# Altium project Spectre-Analyzer.PrjPcb
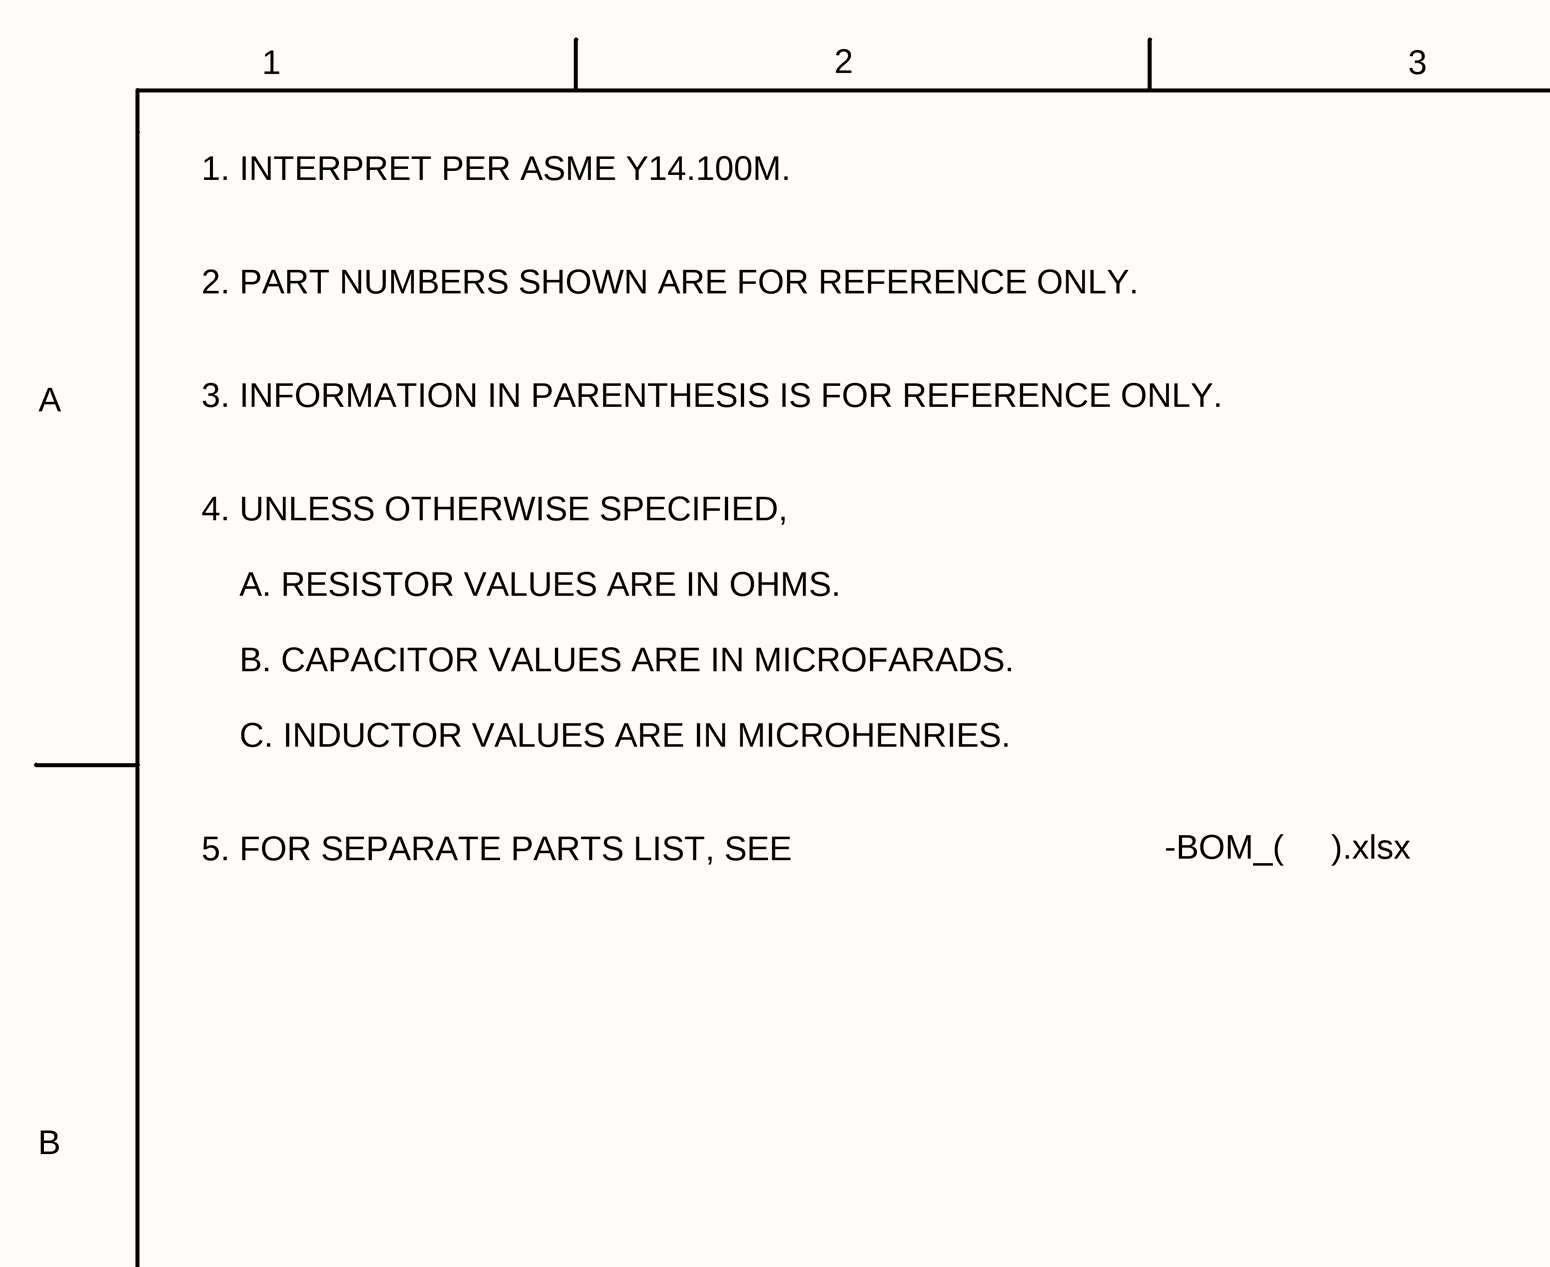
[diagram p0: Spectre-Analyzer-SCH_SH1_(C).SchDoc, top left]
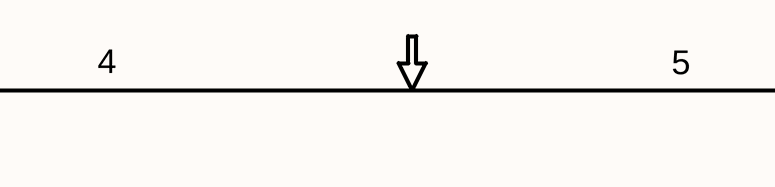
[diagram p1: Spectre-Analyzer-SCH_SH1_(C).SchDoc, top middle]
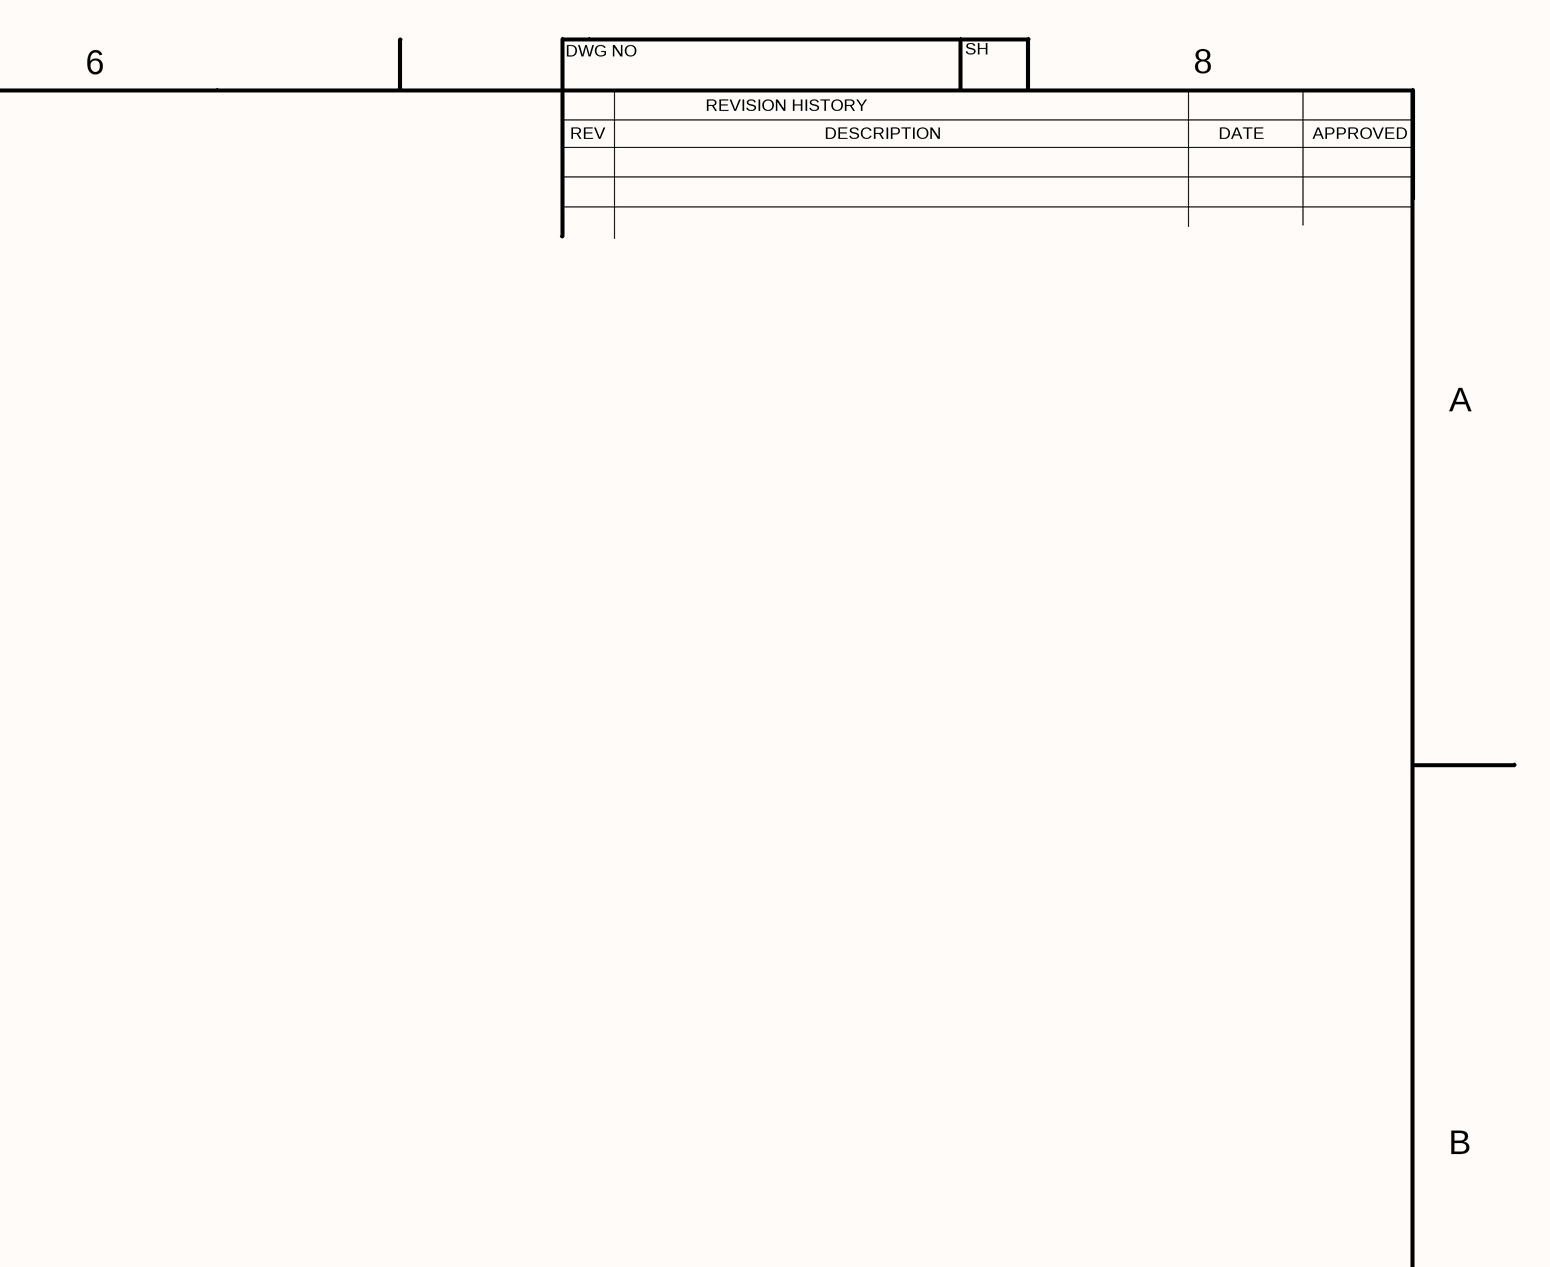
[diagram p2: Spectre-Analyzer-SCH_SH1_(C).SchDoc, top right]
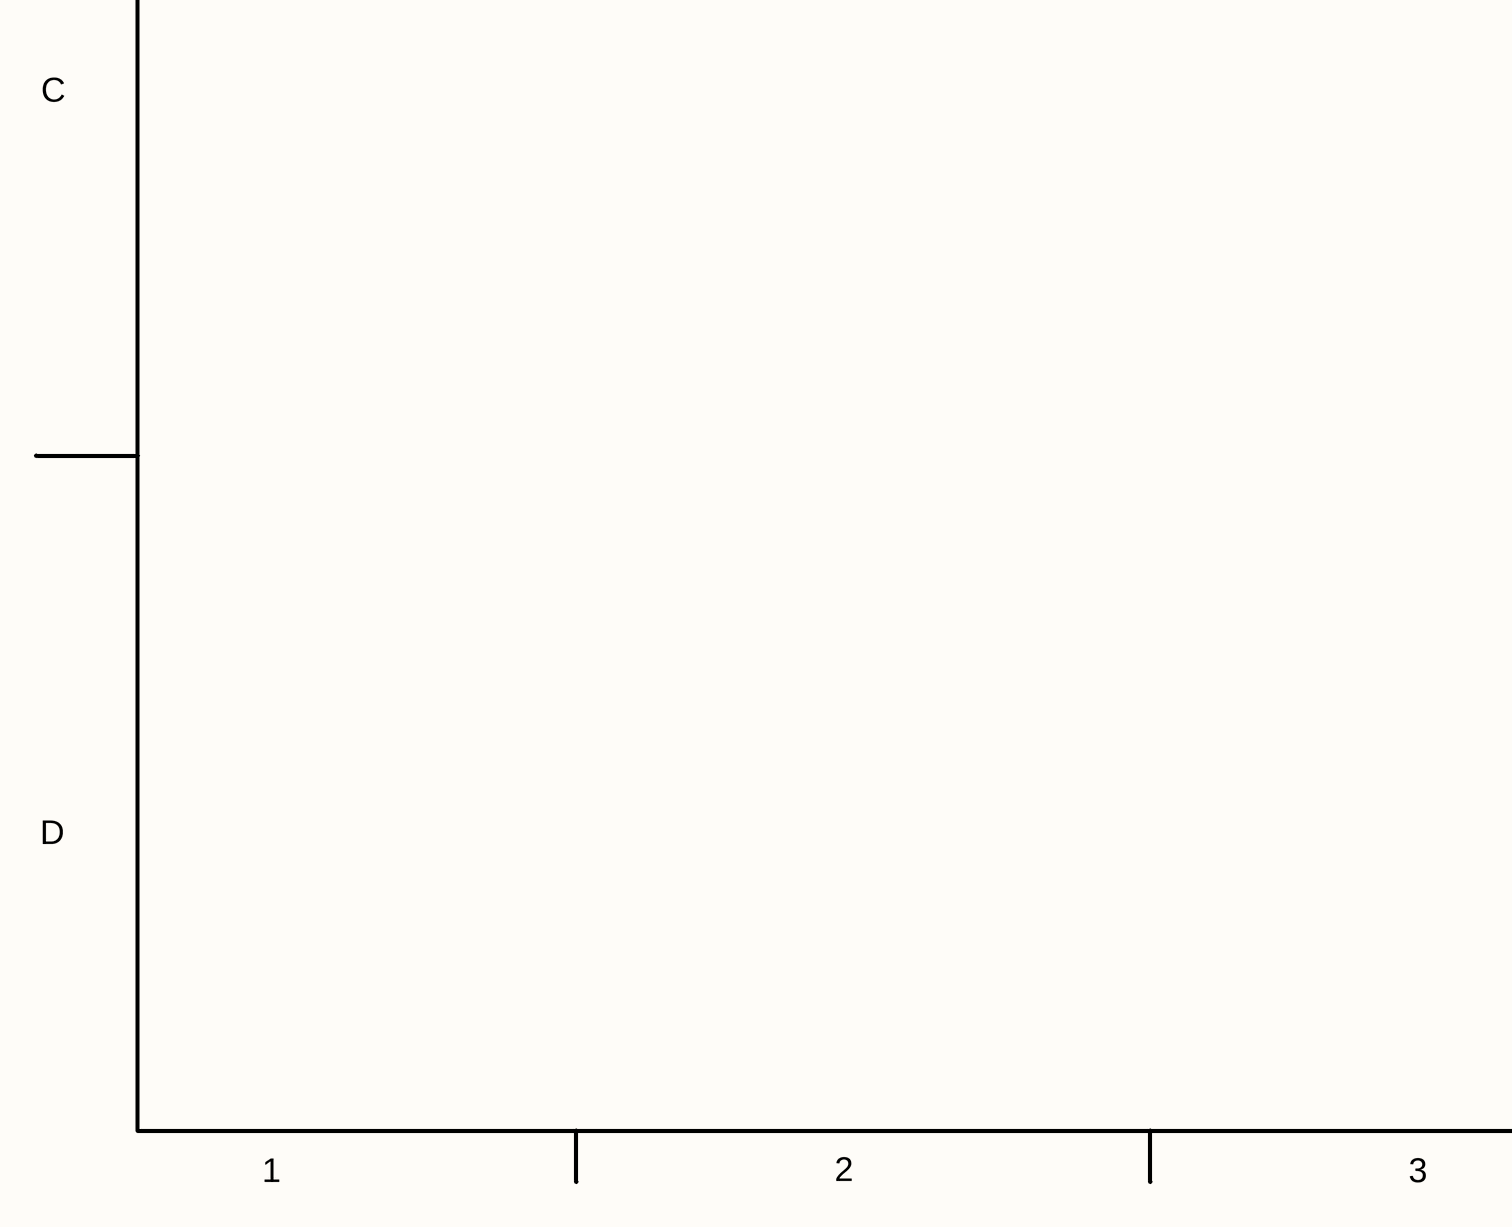
[diagram p3: Spectre-Analyzer-SCH_SH1_(C).SchDoc, bottom left]
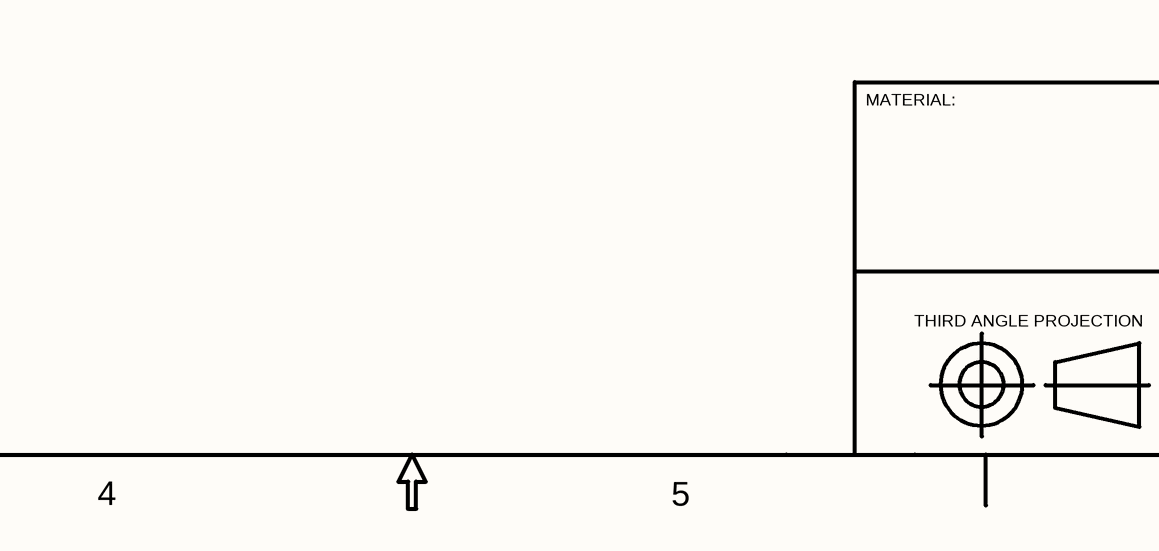
[diagram p4: Spectre-Analyzer-SCH_SH1_(C).SchDoc, bottom middle]
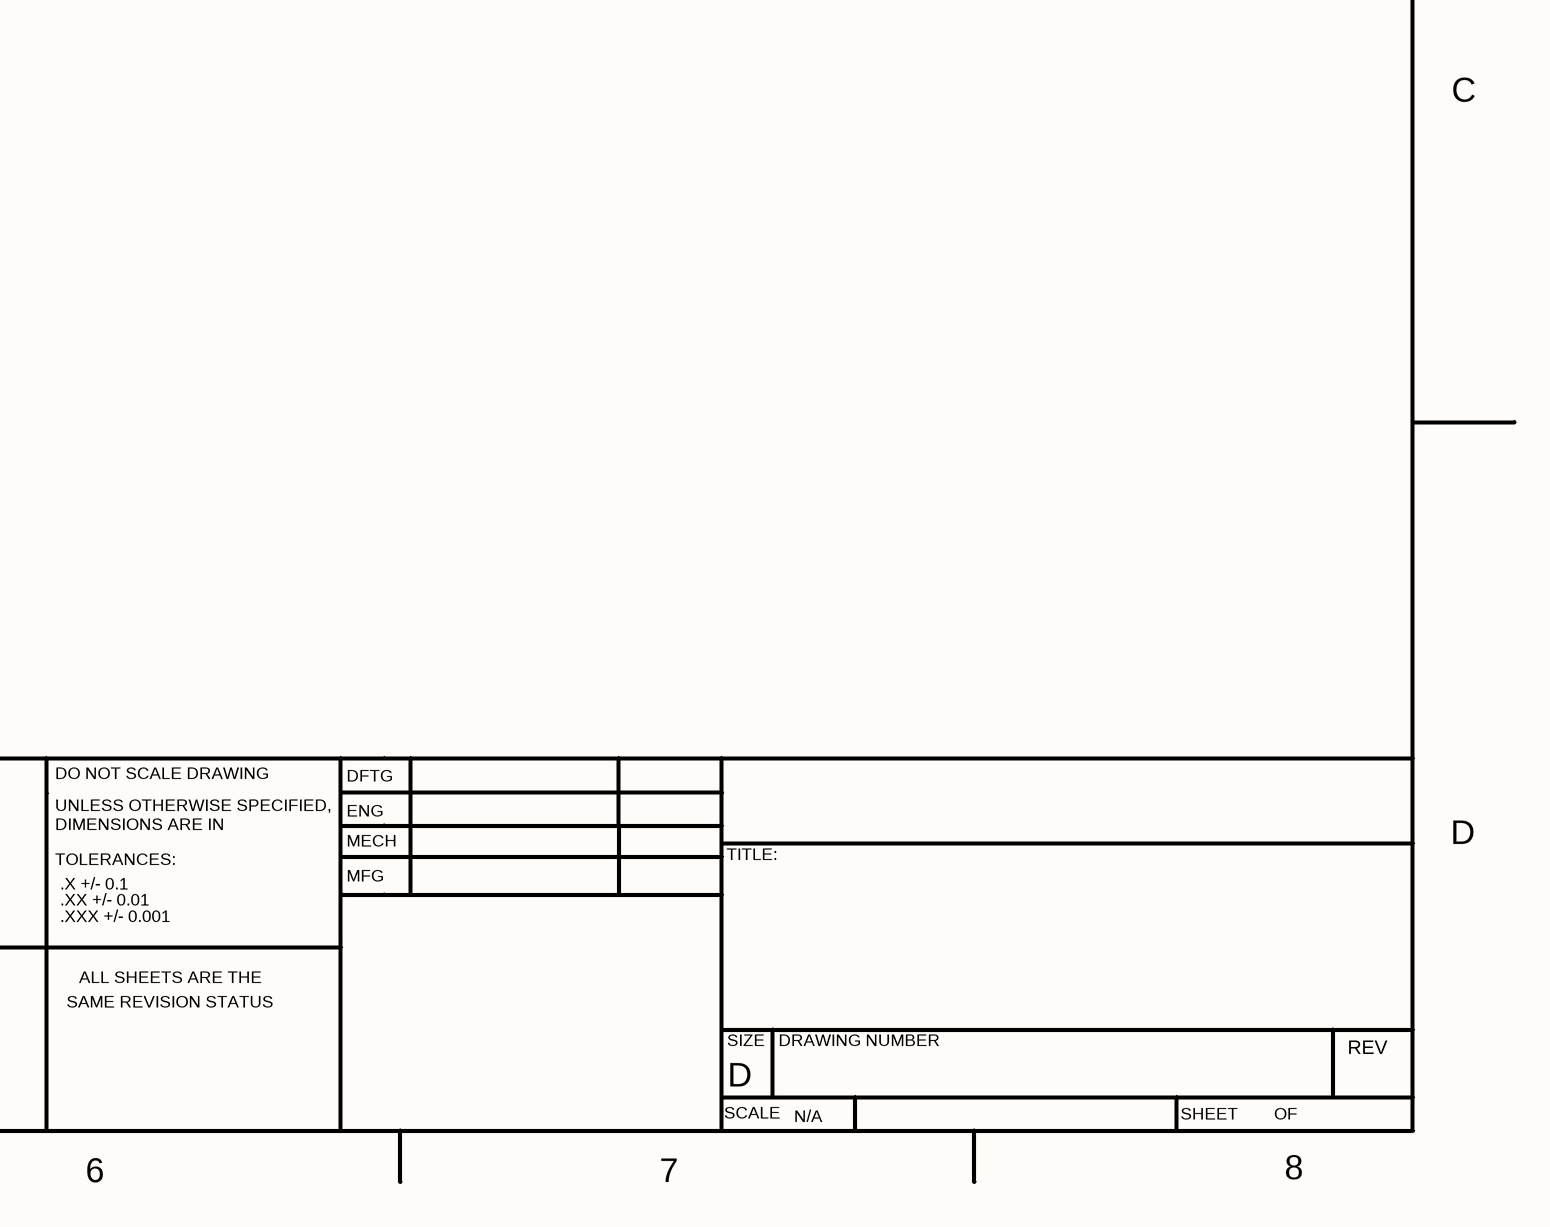
[diagram p5: Spectre-Analyzer-SCH_SH1_(C).SchDoc, bottom right]
Company: -; DateDftg: 10/16/2022; DateEng: 10/16/2022; DocNumber: Spectre; DocNumberPCB: Spectre-PCB; Hist1Appr: -; Hist1Date: 11/08/21; Hist1Desc: INITIAL PROTOTYPE DESIGN; Hist1Rev: A; Hist2Appr: -; Hist2Date: 01/06/2022; Hist2Desc: FORM FACTOR REDUCTION; Hist2Rev: B; Hist3Appr: -; Hist3Date: 10/16/2022; Hist3Desc: MICROCONTROLLER CHANGE; Hist3Rev: C; NameDftg: K. KIDD; NameEng: K. KIDD; Rev: C; Title0: Spectre; Title1: Audio Spectrum Analyzer; TitleCCA: CIRCUIT CARD ASSEMBLY,; TitlePCB: PRINTED CIRCUIT BOARD,; TitleSCH: SCHEMATIC, CCA,
2 sheets, 93 parts. Net scope: global (net labels, ports and power ports of the same name join across sheets).
Board file: Spectre-Analyzer.PcbDoc
Sheets:
  Spectre-Analyzer-SCH_SH1_(C).SchDoc
  Spectre-Analyzer-SCH_SH2_(C).SchDoc

## Sheet Spectre-Analyzer-SCH_SH1_(C).SchDoc: SCHEMATIC, CCA,
size 863 x 558 mm; DocumentNumber: NIR-Spec-1; SheetNumber: 1; SheetTotal: 2

### Notes on the sheet
- 1
- 2
- 3
- 4
- 5
- 6
- DWG NO
- REVISION HISTORY
- SH
- 8
- REV
- DESCRIPTION
- DATE
- APPROVED
- A
- -BOM_(
- ).xlsx
- 1. INTERPRET PER ASME Y14.100M.
  2. PART NUMBERS SHOWN ARE FOR REFERENCE ONLY.
  3. INFORMATION IN PARENTHESIS IS FOR REFERENCE ONLY.
  4. UNLESS OTHERWISE SPECIFIED,
  A. RESISTOR VALUES ARE IN OHMS.
  B. CAPACITOR VALUES ARE IN MICROFARADS.
  C. INDUCTOR VALUES ARE IN MICROHENRIES.
  5. FOR SEPARATE PARTS LIST, SEE
- B
- C
- MATERIAL:
- DO NOT SCALE DRAWING
- UNLESS OTHERWISE SPECIFIED,
- ENG
- DFTG
- D
- DIMENSIONS ARE IN
- TOLERANCES:
- MECH
- MFG
- TITLE:
- .X +/- 0.1
- .XX +/- 0.01
- .XXX +/- 0.001
- THIRD ANGLE PROJECTION
- SAME REVISION STATUS
- ALL SHEETS ARE THE
- SIZE
- DRAWING NUMBER
- SCALE
- N/A
- SHEET        OF
- 7

## Sheet Spectre-Analyzer-SCH_SH2_(C).SchDoc: SCHEMATIC
size 863 x 558 mm; DocumentNumber: NIR-Spec-2; SheetNumber: 2; SheetTotal: 2; PageSetup: Record=PageOptions|CenterHorizontal=True|CenterVertical=True|PrintScale=0.98|XCorrection=1.00|YCorrection=1.00|PrintKind=2|BorderSize=5000000|LeftOffset=0|BottomOffset=0|Orientation=2|PaperLength=1000|PaperWidth=1000|Scale=100|PaperSource=15|PrintQuality=1200|MediaType=1|DitherType=10|PaperKind=11 x 17|PrintScaleMode=1
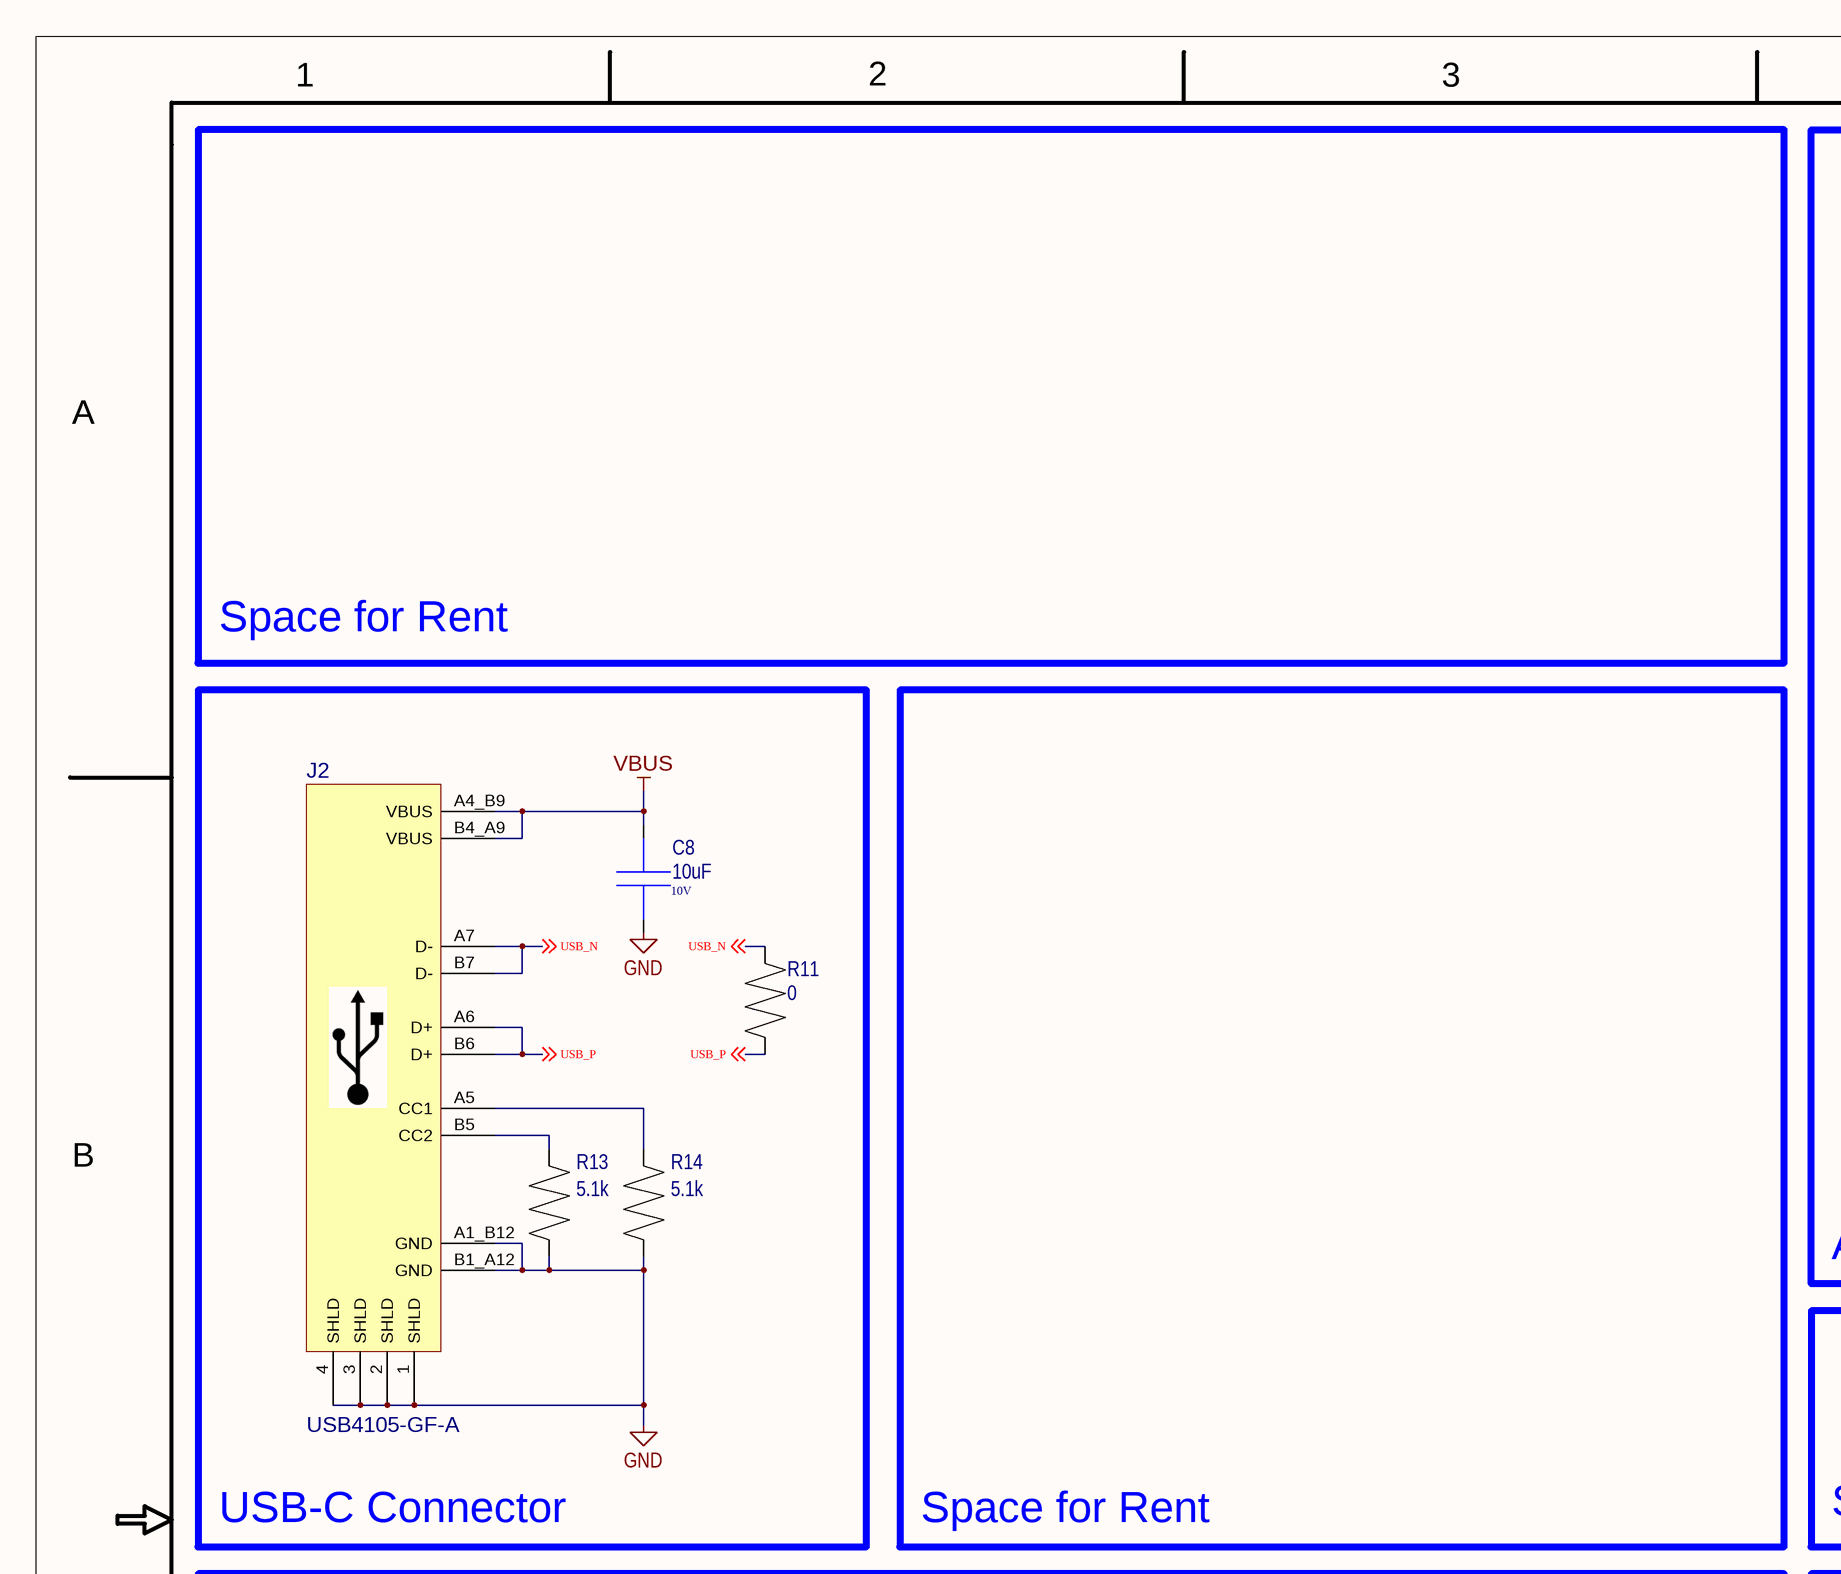
[diagram p6: Spectre-Analyzer-SCH_SH2_(C).SchDoc, top left]
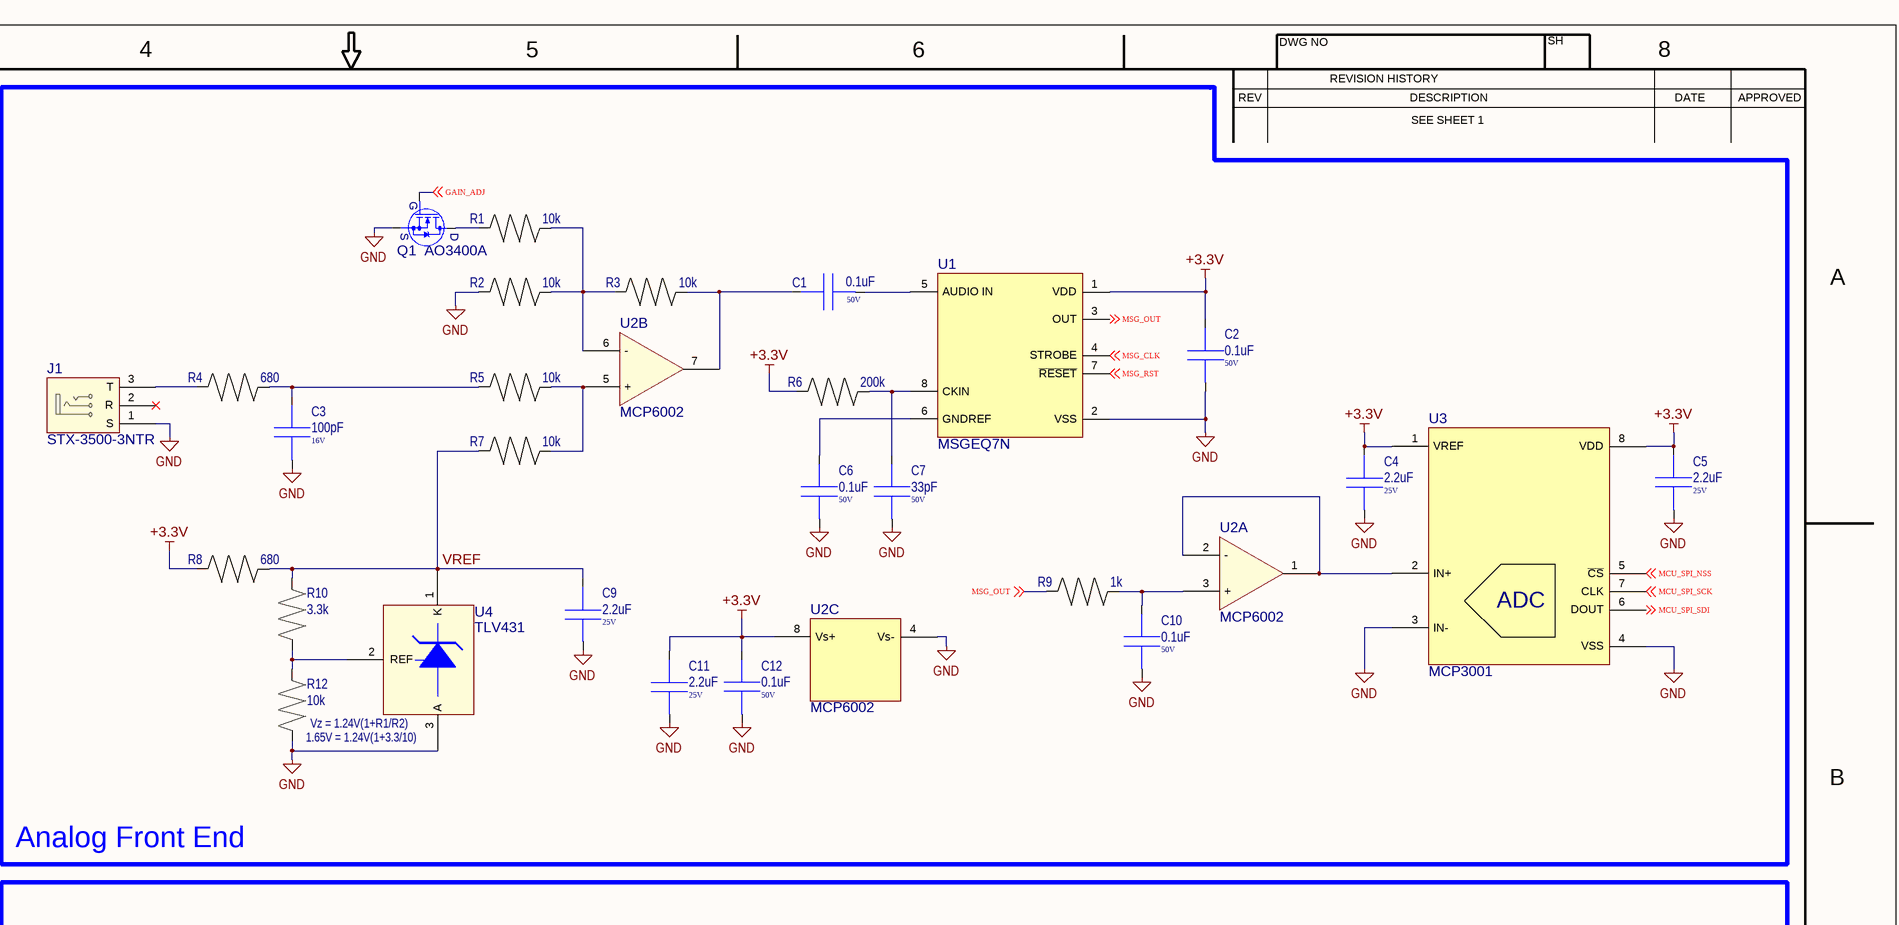
[diagram p7: Spectre-Analyzer-SCH_SH2_(C).SchDoc, top right]
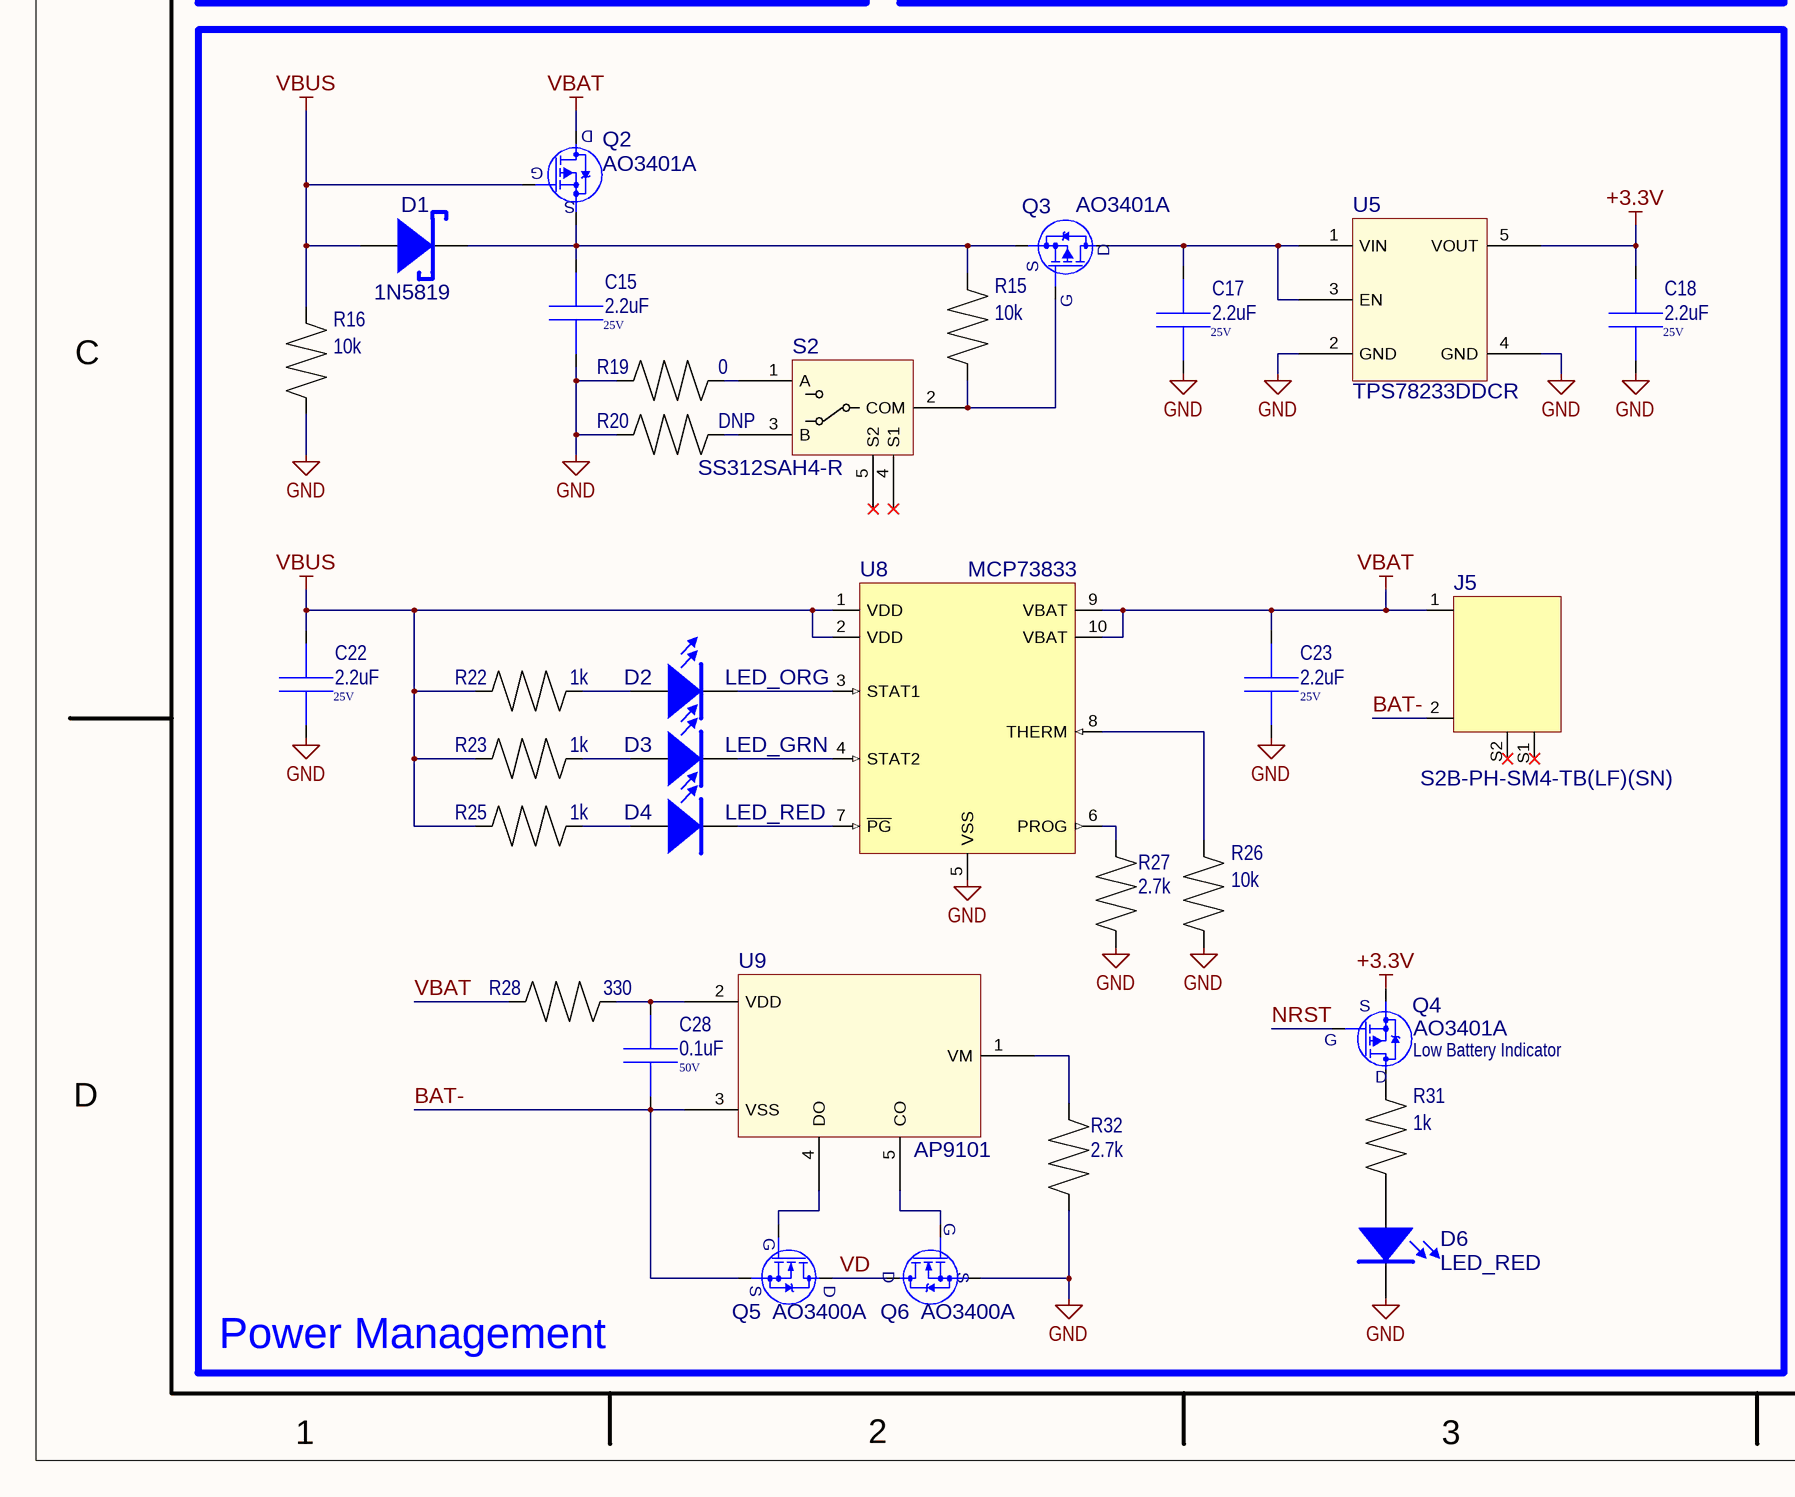
[diagram p8: Spectre-Analyzer-SCH_SH2_(C).SchDoc, bottom left]
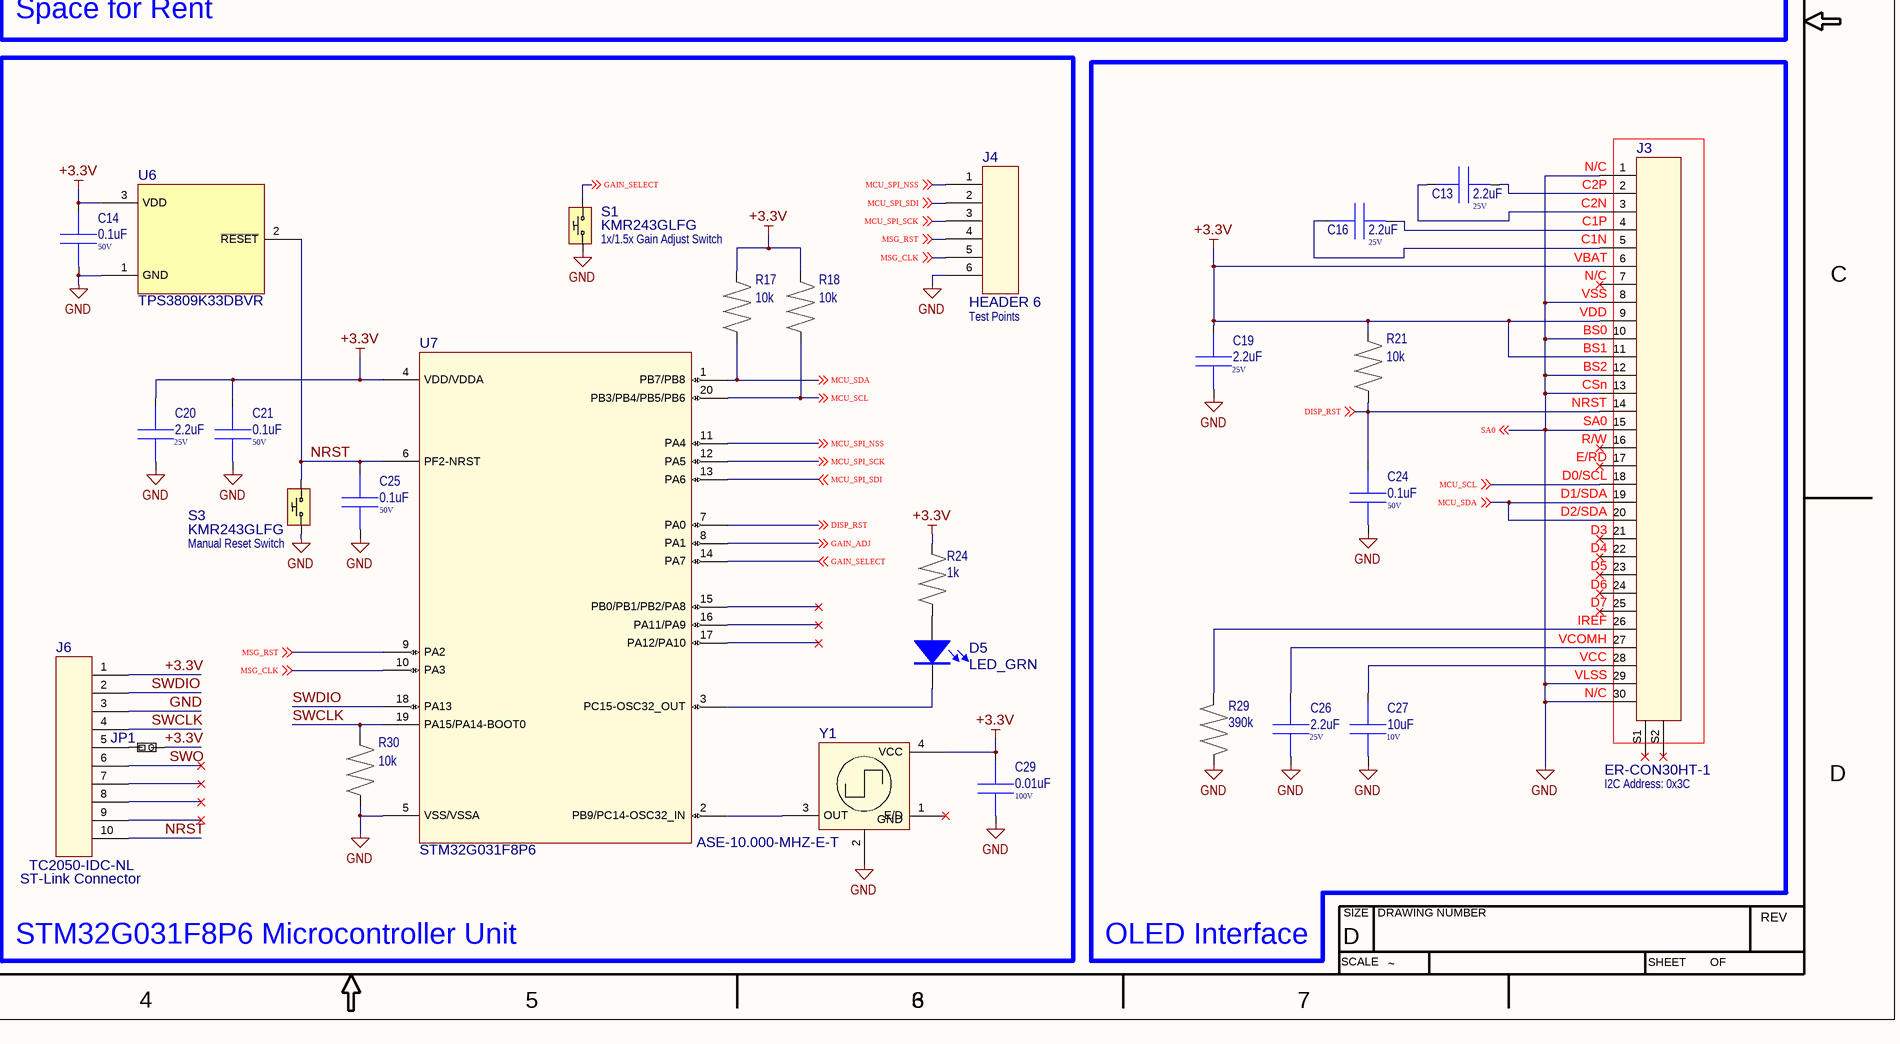
[diagram p9: Spectre-Analyzer-SCH_SH2_(C).SchDoc, bottom right]

### Parts
C1  0.1uF  Voltage: 50V  [0402]
C2  0.1uF  Voltage: 50V  [0402]
C3  100pF  Voltage: 16V  [0402]
C4  2.2uF  Voltage: 25V  [0402]
C5  2.2uF  Voltage: 25V  [0402]
C6  0.1uF  Voltage: 50V  [0402]
C7  33pF  Voltage: 50V  [0402]
C8  10uF  Voltage: 10V  [0402]
C9  2.2uF  Voltage: 25V  [0402]
C10  0.1uF  Voltage: 50V  [0402]
C11  2.2uF  Voltage: 25V  [0402]
C12  0.1uF  Voltage: 50V  [0402]
C13  2.2uF  Voltage: 25V  [0402]
C14  0.1uF  Voltage: 50V  [0402]
C15  2.2uF  Voltage: 25V  [0402]
C16  2.2uF  Voltage: 25V  [0402]
C17  2.2uF  Voltage: 25V  [0402]
C18  2.2uF  Voltage: 25V  [0402]
C19  2.2uF  Voltage: 25V  [0402]
C20  2.2uF  Voltage: 25V  [0402]
C21  0.1uF  Voltage: 50V  [0402]
C22  2.2uF  Voltage: 25V  [0402]
C23  2.2uF  Voltage: 25V  [0402]
C24  0.1uF  Voltage: 50V  [0402]
C25  0.1uF  Voltage: 50V  [0402]
C26  2.2uF  Voltage: 25V  [0402]
C27  10uF  Voltage: 10V  [0402]
C28  0.1uF  Voltage: 50V  [0402]
C29  0.01uF  Voltage: 100V  [0402]
D1  1N5819  [SOD-123]
D2  LED_ORG  [0603_LED_Red]
D3  LED_GRN  [0603_LED_Red]
D4  LED_RED  [0603_LED_Red]
D5  LED_GRN  [0603_LED_Red]
D6  LED_RED  [0603_LED_Red]
J1  STX-3500-3NTR  [STX-3500-3NTR]
J2  USB4105-GF-A  [USB4105-GF-A]
J3  ER-CON30HT-1  [ER-CON30HT-1]
J4  HEADER 6  [801-43-006-10-012000]
J5  S2B-PH-SM4-TB(LF)(SN)  [S2B-PH-SM4-TB(LF)(SN)]
J6  TC2050-IDC-NL  [TC2050-IDC-NL-FP]  (no BOM)
JP1  Solder Jumper  [SOLDER JUMPER]  (value not drawn)  (no BOM)
Q1  AO3400A  [SOT-23-3]
Q2  AO3401A  [SOT-23]
Q3  AO3401A  [SOT-23]
Q4  AO3401A  [SOT-23]
Q5  AO3400A  [SOT-23-3]
Q6  AO3400A  [SOT-23-3]
R1  10k  [0402]
R2  10k  [0402]
R3  10k  [0402]
R4  680  [0402]
R5  10k  [0402]
R6  200k  [0402]
R7  10k  [0402]
R8  680  [0402]
R9  1k  [0402]
R10  3.3k  [0402]
R11  0  [0402]
R12  10k  [0402]
R13  5.1k  [0402]
R14  5.1k  [0402]
R15  10k  [0402]
R16  10k  [0402]
R17  10k  [0402]
R18  10k  [0402]
R19  0  [0402]
R20  DNP  [0402]
R21  10k  [0402]
R22  1k  [0402]
R23  1k  [0402]
R24  1k  [0402]
R25  1k  [0402]
R26  10k  [0402]
R27  2.7k  [0402]
R28  330  [0402]
R29  390k  [0402]
R30  10k  [0402]
R31  1k  [0402]
R32  2.7k  [0402]
S1  KMR243GLFG  [KMR 2 Series]
S2  SS312SAH4-R  [SW_SS312SAH4-R]
S3  KMR243GLFG  [KMR 2 Series]
U1  MSGEQ7N  [SOIC-8]
U2  MCP6002  [SOIC-8]  (parts A,B,C of 3)
U3  MCP3001  [SOIC-8]
U4  TLV431  [SOT-23-3]
U5  TPS78233DDCR  [TSOT23-5]
U6  TPS3809K33DBVR  [SOT-23-3]
U7  STM32G031F8P6  [TSSOP-20]
U8  MCP73833  [MSOP-10]
U9  AP9101  [TSOT23-5]
Y1  ASE-10.000-MHZ-E-T  [ASE-XXXXX-X-X-X]

### Blocks framed on the sheet
Analog Front End: C1-C7 C9-C12 J1 Q1 R1-R10 R12 U1-U4
USB-C Connector: C8 J2 R11 R13 R14
Power Management: C15 C17 C18 C22 C23 C28 D1-D4 D6 J5 Q2-Q6 R15 R16 R19 R20 R22 R23 R25-R28 R31 R32 S2 U5 U8 U9
STM32G031F8P6 Microcontroller Unit: C14 C20 C21 C25 C29 D5 J4 J6 JP1 R17 R18 R24 R30 S1 S3 U6 U7 Y1
OLED Interface: C13 C16 C19 C24 C26 C27 J3 R21 R29

### Nets
+3.3V: C2.2 C4.2 C5.2 C11.2 C12.2 C14.2 C18.2 C19.2 C20.2 C21.2 C29.2 J3.6 J3.9 J3.11 J6.1 JP1.2 Q4.3(S) R6.1 R8.1 R17.2 R18.2 R21.2 R24.2 U1.1(VDD) U2.8(Vs+) U3.1(VREF) U3.8(VDD) U5.5(VOUT) U6.3(VDD) U7.4(VDD/VDDA) Y1.4(VCC)
GND: C2.1 C3.1 C4.1 C5.1 C6.1 C7.1 C8.1 C9.1 C10.1 C11.1 C12.1 C14.1 C15.1 C17.1 C18.1 C19.1 C20.1 C21.1 C22.1 C23.1 C24.1 C25.1 C26.1 C27.1 C29.1 D6.2(K) J1.1(S) J2.1(SHLD) J2.2(SHLD) J2.3(SHLD) J2.4(SHLD) J2.A1_B12(GND) J2.B1_A12(GND) J3.1 J3.8 J3.10 J3.12 J3.13 J3.15 J3.29 J3.30 J4.6 J6.3 Q1.3(S) Q6.3(S) R2.1 R12.2 R13.1 R14.1 R16.1 R19.2 R20.2 R26.1 R27.2 R29.1 R30.1 R32.2 S1.1 S3.1 U1.2(VSS) U2.4(Vs-) U3.3(IN-) U3.4(VSS) U4.3(A) U5.2(GND) U5.4(GND) U6.1(GND) U7.5(VSS/VSSA) U8.5(VSS) Y1.2(GND) ; off-sheet SA0  [also labelled SA0]
VBAT: C23.2 J5.1 Q2.2(D) R28.1 U8.9(VBAT) U8.10(VBAT)
VBUS: C8.2 C22.2 D1.1(A) J2.A4_B9(VBUS) J2.B4_A9(VBUS) Q2.1(G) R16.2 R22.1 R23.1 R25.1 U8.1(VDD) U8.2(VDD)
BAT-: C28.1 J5.2 Q5.3(S) U9.3(VSS)
DISP_RST: C24.2 J3.14 R21.1 U7.7(PA0) ; off-sheet DISP_RST
GAIN_ADJ: Q1.1(G) U7.8(PA1) ; off-sheet GAIN_ADJ
GAIN_SELECT: S1.2 U7.14(PA7) ; off-sheet GAIN_SELECT
MCU_SCL: J3.18 R18.1 U7.20(PB3/PB4/PB5/PB6) ; off-sheet MCU_SCL
MCU_SDA: J3.19 J3.20 R17.1 U7.1(PB7/PB8) ; off-sheet MCU_SDA
MCU_SPI_NSS: J4.1 U3.5(~{CS}) U7.11(PA4) ; off-sheet MCU_SPI_NSS
MCU_SPI_SCK: J4.3 U3.7(CLK) U7.12(PA5) ; off-sheet MCU_SPI_SCK
MCU_SPI_SDI: J4.2 U3.6(DOUT) U7.13(PA6) ; off-sheet MCU_SPI_SDI
MSG_CLK: J4.5 U1.4(STROBE) U7.10(PA3) ; off-sheet MSG_CLK
MSG_OUT: R9.1 U1.3(OUT) ; off-sheet MSG_OUT
MSG_RST: J4.4 U1.7(~{RESET}) U7.9(PA2) ; off-sheet MSG_RST
NRST: C25.2 J6.10 Q4.1(G) S3.2 U6.2(~{RESET}) U7.6(PF2-NRST)
SWCLK: J6.4 R30.2 U7.19(PA15/PA14-BOOT0)
SWDIO: J6.2 U7.18(PA13)
SWO: J6.6
USB_N: J2.A7(D-) J2.B7(D-) R11.1 ; off-sheet USB_N
USB_P: J2.A6(D+) J2.B6(D+) R11.2 ; off-sheet USB_P
VD: Q5.2(D) Q6.2(D)
VREF: C9.2 R7.1 R8.2 R10.1 U4.1(K)
NetC1_1: C1.1 U1.5(AUDIO_IN)
NetC1_2: C1.2 R3.2 U2.7(OUT)
NetC3_2: C3.2 R4.2 R5.1
NetC6_2: C6.2 U1.6(GNDREF)
NetC7_2: C7.2 R6.2 U1.8(CKIN)
NetC10_2: C10.2 R9.2 U2.3(+)
NetC13_1: C13.1 J3.2
NetC13_2: C13.2 J3.3
NetC15_2: C15.2 D1.2(K) Q2.3(S) Q3.3(S) R15.2
NetC16_1: C16.1 J3.4
NetC16_2: C16.2 J3.5
NetC17_2: C17.2 Q3.2(D) U5.1(VIN) U5.3(EN)
NetC26_2: C26.2 J3.27
NetC27_2: C27.2 J3.28
NetC28_2: C28.2 R28.2 U9.2(VDD)
NetD2_1: D2.1(A) R22.2
NetD2_2: D2.2(K) U8.3(STAT1)
NetD3_1: D3.1(A) R23.2
NetD3_2: D3.2(K) U8.4(STAT2)
NetD4_1: D4.1(A) R25.2
NetD4_2: D4.2(K) U8.7(~{PG})
NetD5_1: D5.1(A) R24.1
NetD5_2: D5.2(K) U7.3(PC15-OSC32_OUT)
NetD6_1: D6.1(A) R31.1
NetJ1_3: J1.3(T) R4.1
NetJ2_A5: J2.A5(CC1) R14.2
NetJ2_B5: J2.B5(CC2) R13.2
NetJ3_26: J3.26 R29.2
NetJ6_5: J6.5 JP1.1
NetQ1_2: Q1.2(D) R1.1
NetQ3_1: Q3.1(G) R15.1 S2.2(COM)
NetQ4_2: Q4.2(D) R31.2
NetQ5_1: Q5.1(G) U9.4(DO)
NetQ6_1: Q6.1(G) U9.5(CO)
NetR1_2: R1.2 R2.2 R3.1 U2.6(-)
NetR5_2: R5.2 R7.2 U2.5(+)
NetR10_2: R10.2 R12.1 U4.2(REF)
NetR19_1: R19.1 S2.1(A)
NetR20_1: R20.1 S2.3(B)
NetR26_2: R26.2 U8.8(THERM)
NetR27_1: R27.1 U8.6(PROG)
NetR32_1: R32.1 U9.1(VM)
NetU2_1: U2.1(OUT) U2.2(-) U3.2(IN+)
NetU7_2: U7.2(PB9/PC14-OSC32_IN) Y1.3(OUT)

Not connected (* = marked no-connect by the designer): J1 2(R)*; J3 7* 16* 17* 21* 22* 23* 24* 25* S1* S2*; J5 S1* S2*; J6 7* 8* 9*; S2 4(S1)* 5(S2)*; U7 15(PB0/PB1/PB2/PA8)* 16(PA11/PA9)* 17(PA12/PA10)*; Y1 1(E/D)*

### Notes on the sheet
- 1
- 2
- 3
- 4
- 5
- 6
- DWG NO
- REVISION HISTORY
- SH
- 8
- REV
- DESCRIPTION
- SEE SHEET 1
- DATE
- APPROVED
- A
- Space for Rent
- 1.65V = 1.24V(1+3.3/10)
- (near U4) Vz = 1.24V(1+R1/R2)
- B
- (near J3) N/C
- (near J3) C2P
- (near J3) C2N
- (near S1) 1x/1.5x Gain Adjust Switch
- (near J3) C1P
- (near J3) C1N
- (near J3) VBAT
- C
- (near J3) VSS
- (near J4) Test Points
- (near J3) VDD
- (near J3) BS0
- (near J3) BS1
- (near J3) BS2
- (near J3) CSn
- (near J3) NRST
- (near J3) SA0
- (near J3) R/W
- (near J3) E/RD
- (near J3) D0/SCL
- (near J3) D1/SDA
- (near J3) D2/SDA
- (near J3) D3
- (near S3) Manual Reset Switch
- (near J3) D4
- (near J3) D5
- (near J3) D6
- (near J3) D7
- (near J3) IREF
- (near J3) VCOMH
- (near J3) VCC
- (near J3) VLSS
- Low Battery Indicator
- D
- I2C Address: 0x3C
- (near J6) ST-Link Connector
- SIZE
- DRAWING NUMBER
- SCALE
- ~
- SHEET        OF
- 7
- (in symbol MCP3001) ADC

### Library data of the parts
C1 C2 C6 C10 C12 C14 C21 C24 C25 C28 = CAP: CAP CER 0.1UF 50V X7R 0402; Part Number: UMK105B7104KVHF; Manufacturer: Taiyo Yuden; ClassName: Interface
C3 = CAP: CAP CER 100PF 16V X7R 0402; Part Number: VJ0402Y101KXJCW1BC; Manufacturer: Vishay Vitramon
C4 C5 C9 C11 C15 C17 C18 C20 C22 C23 = CAP: CAP CER 2.2UF 25V X5R 0402; Part Number: GRM155R61E225KE11D; Manufacturer: Murata Electronics
  C15 C17 C18 C20 C22 C23: ClassName: Interface
C7 = CAP: CAP CER 33PF 50V X7R 0402; Part Number: 04025C330JAT2A; Manufacturer: KYOCERA AVX; ClassName: Interface
C8 C27 = CAP: CAP CER 10UF 10V X5R 0402; Part Number: CL05A106MP5NUNC; Manufacturer: Samsung Electro-Mechanics; ClassName: -
C13 C16 C19 C26 = CAP: CAP CER 2.2UF 25V X5R 0402; Part Number: GRM188C81A106MA73D; Manufacturer: Murata Electronics; ClassName: Interface
C29 = CAP: CAP CER 0.01UF 100V X7R 0402; Part Number: HMR105B7103MV-F; Manufacturer: Taiyo Yuden; ClassName: Interface
D1 = DIODE_SCHOTTKY: DIODE SCHOTTKY 40V 1A SOD123; Manufacturer: Diodes Incorporated; Part Number: 1N5819HW-7-F; ClassName: Power Input
D2-D6 = LED_Red: Standard LEDs - SMD HE Red 645 nm Water Clear; Part Number: SM0603HCL; Manufacturer: Bivar; ClassName: Interface
J1 = STX-3500-3NTR: CONN JACK STEREO 3.5MM SMD R/A; Manufacturer: Kycon, Inc.; Part Number: STX-3500-3NTR
J2 = USB4105-GF-A: CONN RCP USB2.0 TYP C 24P SMD RA; Manufacturer: GCT; Part Number: USB4105-GF-A
J3 = ER-CON30HT-1: 30 PINS 0.5 PITCH SMD TOP CONTACT CONN; Manufacturer: EastRising Technology; Part Number: ER-CON30HT-1
J4 = 801-43-006-10-012000: CONN SOCKET STRIP 6 POS 0.1"; Manufacturer: Mill-Max; Part Number: 801-43-006-10-012000
J5 = S2B-PH-SM4-TB(LF)(SN): CONN HEADER SMD R/A 2POS 2MM; Manufacturer: JST Sales America Inc.; Part Number: S2B-PH-SM4-TB(LF)(SN)
J6 = TC2050-IDC-NL: CBL PLUG-OF-NAILS 10-PIN; Manufacturer: Tag-Connect LLC; Part Number: TC2050-IDC-NL
JP1 = SolderJumper_Single: Solder Jumper Single 0.5mm Pitch
Q1 Q5 Q6 = MOSFET_N: MOSFET N-CH 30V 5.7A SOT23-3L; Manufacturer: Alpha & Omega Semiconductor Inc.; Part Number: AO3400A
Q2-Q4 = MOSFET_P: MOSFET P-CH 30V 4A SOT23-3L; Manufacturer: Alpha & Omega Semiconductor Inc.; Part Number: AO3401A; ClassName: Power Input
R1-R3 R5 R7 R12 R15-R18 R21 R26 R30 = RES: RES SMD 10K OHM 1% 1/16W 0402; Part Number: CR0402-FX-1002GLF; Manufacturer: Bourns
  R15-R18 R21 R26 R30: ClassName: Power Input
R4 R8 = RES: RES SMD 680 OHM 1% 1/16W 0402; Part Number: CR0402-FX-6800GLF; Manufacturer: Bourns
R6 = RES: RES SMD 200K OHM 1% 1/16W 0402; Part Number: CR0402-FX-2003GLF; Manufacturer: Bourns
R9 R22-R25 = RES: RES 1K OHM 1% 1/16W 0402; Part Number: CR0402AFX-1001GLF; Manufacturer: Bourns
  R24: ClassName: Interface
R10 = RES: RES SMD 3.3K OHM 1% 1/16W 0402; Part Number: CR0402-FX-3301GLF; Manufacturer: Bourns
R11 R19 R20 = RES: Thick Film Resistors - SMD 1/16watt 0ohm Commercial Use; Part Number: CRCW04020000Z0EDC; Manufacturer: Vishay / Dale; ClassName: -
R13 R14 = RES: RES SMD 5.1K OHM 1% 1/16W 0402; Part Number: CRCW04025K10FKED; Manufacturer: Vishay / Dale; ClassName: -
R27 R32 = RES: RES SMD 2.7K OHM 1% 1/16W 0402; Part Number: CR0402-FX-2701GLF; Manufacturer: Bourns; ClassName: Interface
R28 = RES: RES 330 OHM 1% 1/16W 0402; Part Number: CR0402AFX-3300GLF; Manufacturer: Bourns
R29 = RES: RES SMD 390K OHM 1% 1/16W 0402; Part Number: CR0402-FX-3903GLF; Manufacturer: Bourns Inc.; ClassName: Interface
R31 = RES: RES SMD 1K OHM 1% 1/16W 0402; Part Number: CR0402-FX-1001GLF; Manufacturer: Bourns; ClassName: Power Input
S1 S3 = KMR 2 Series: SWITCH TACTILE SPST-NO 0.01A 32V; Manufacturer: C&K; Part Number: KMR243GLFG
S2 = SS312SAH4-R: SWITCH SLIDE SPDT 0.4VA 28V; Manufacturer: NKK Switches; Part Number: SS312SAH4-R
U1 = MSGEQ7: SWITCHED CAPA AUDIO ANALYZER SOIC-8; Manufacturer: Mixed Signal Integrated; Part Number: MSGEQ7N
U2 = AD8072: IC OPAMP GP 2 CIRCUIT 8SOIC; Part Number: MCP6002-E/SN; Manufacturer: Microchip Technology
U3 = MCP3001: IC ADC 10BIT SAR 8SOIC; Manufacturer: Microchip Technology; Part Number: MCP3001T-I/SN
U4 = TL431xxDBZR: IC VREF SHUNT ADJ SOT23-3; Manufacturer: onsemi; Part Number: TLV431ASN1T1G
U5 = TPS782xxDDCR: IC REG LINEAR 3.3V 150MA SOT23-5; Manufacturer: Texas Instruments; Part Number: TPS78233DDCR
U6 = TPS3809x: IC SUPERVISOR 1 CHANNEL SOT23-3; Manufacturer: Texas Instruments; Part Number: TPS3809K33DBVR
U7 = STM32G031FxP6: IC MCU 32BIT 64KB FLASH 20TSSOP; Manufacturer: STMicroelectronics; Part Number: STM32G031F8P6
U8 = MCP73833: IC BATT CNTRL LI-ION 1CEL 10MSOP; Part Number: MCP73833-CNI/UN; Manufacturer: Microchip
U9 = AP9101CAK-AKTRG1: IC BATT PROT LI-ION 1CELL SOT25; Manufacturer: Diodes Incorporated; Part Number: AP9101CAK-AKTRG1
Y1 = ASE-XXXXX-MHZ-X-X: OSC XO 10.000MHZ CMOS SMD; Manufacturer: Abracon; Part Number: ASE-10.000-MHZ-E-T; ClassName: Interface